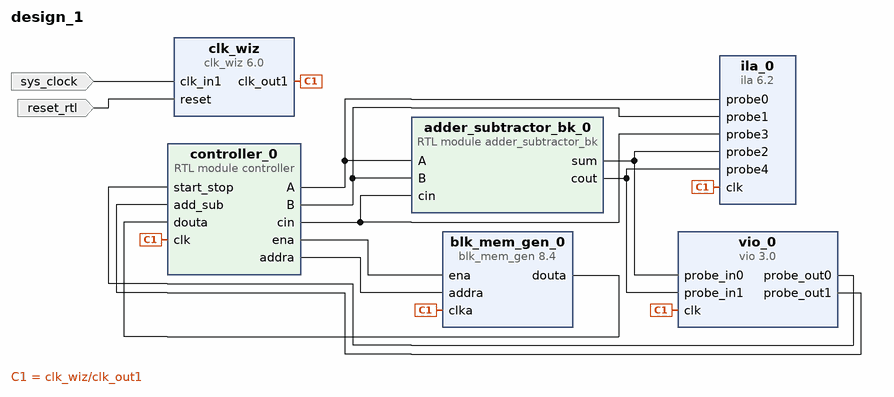
[diagram p0: block diagram of the top level]
# Vivado block design design_1, xc7z020clg400-1, Vivado 2020.2
create_bd_design design_1

create_bd_port -dir I -type clk sys_clock
set_property -dict {CONFIG.FREQ_HZ 125000000 CONFIG.PHASE 0.000} [get_bd_ports sys_clock]
create_bd_port -dir I -type rst reset_rtl
set_property -dict {CONFIG.POLARITY ACTIVE_HIGH} [get_bd_ports reset_rtl]

create_bd_cell -type ip -vlnv xilinx.com:ip:vio:3.0 vio_0
set_property -dict {CONFIG.C_NUM_PROBE_IN 2 CONFIG.C_NUM_PROBE_OUT 2} [get_bd_cells vio_0]
create_bd_cell -type ip -vlnv xilinx.com:ip:blk_mem_gen:8.4 blk_mem_gen_0
set_property -dict [list \
  CONFIG.Coe_File bram.coe \
  CONFIG.Enable_32bit_Address false \
  CONFIG.Load_Init_File true \
  CONFIG.Read_Width_A 64 \
  CONFIG.Register_PortA_Output_of_Memory_Primitives true \
  CONFIG.Use_Byte_Write_Enable false \
  CONFIG.Use_RSTA_Pin false \
  CONFIG.Write_Depth_A 16 \
  CONFIG.Write_Width_A 64 \
  CONFIG.use_bram_block Stand_Alone \
] [get_bd_cells blk_mem_gen_0]
create_bd_cell -type ip -vlnv xilinx.com:ip:ila:6.2 ila_0
set_property -dict [list \
  CONFIG.C_ENABLE_ILA_AXI_MON false \
  CONFIG.C_MONITOR_TYPE Native \
  CONFIG.C_NUM_OF_PROBES 5 \
  CONFIG.C_PROBE0_WIDTH 32 \
  CONFIG.C_PROBE1_WIDTH 32 \
  CONFIG.C_PROBE2_WIDTH 32 \
] [get_bd_cells ila_0]
create_bd_cell -type ip -vlnv xilinx.com:ip:clk_wiz:6.0 clk_wiz
set_property -dict {CONFIG.CLK_IN1_BOARD_INTERFACE sys_clock CONFIG.USE_BOARD_FLOW true} [get_bd_cells clk_wiz]
create_bd_cell -type module -reference adder_subtractor_bk adder_subtractor_bk_0
create_bd_cell -type module -reference controller controller_0

# ---- connections ----

connect_bd_net [get_bd_pins controller_0/A] [get_bd_pins ila_0/probe0] [get_bd_pins adder_subtractor_bk_0/A]
connect_bd_net [get_bd_pins controller_0/B] [get_bd_pins ila_0/probe1] [get_bd_pins adder_subtractor_bk_0/B]
connect_bd_net [get_bd_pins controller_0/cin] [get_bd_pins ila_0/probe3] [get_bd_pins adder_subtractor_bk_0/cin]
connect_bd_net [get_bd_pins vio_0/probe_out0] [get_bd_pins controller_0/start_stop]
connect_bd_net [get_bd_pins vio_0/probe_out1] [get_bd_pins controller_0/add_sub]
connect_bd_net [get_bd_pins controller_0/ena] [get_bd_pins blk_mem_gen_0/ena]
connect_bd_net [get_bd_pins controller_0/addra] [get_bd_pins blk_mem_gen_0/addra]
connect_bd_net [get_bd_pins blk_mem_gen_0/douta] [get_bd_pins controller_0/douta]
connect_bd_net [get_bd_pins adder_subtractor_bk_0/sum] [get_bd_pins vio_0/probe_in0] [get_bd_pins ila_0/probe2]
connect_bd_net [get_bd_pins adder_subtractor_bk_0/cout] [get_bd_pins vio_0/probe_in1] [get_bd_pins ila_0/probe4]
connect_bd_net [get_bd_pins clk_wiz/clk_out1] \
  [get_bd_pins vio_0/clk] [get_bd_pins ila_0/clk] [get_bd_pins blk_mem_gen_0/clka] [get_bd_pins controller_0/clk]
connect_bd_net [get_bd_ports sys_clock] [get_bd_pins clk_wiz/clk_in1]
connect_bd_net [get_bd_ports reset_rtl] [get_bd_pins clk_wiz/reset]

validate_bd_design
save_bd_design
